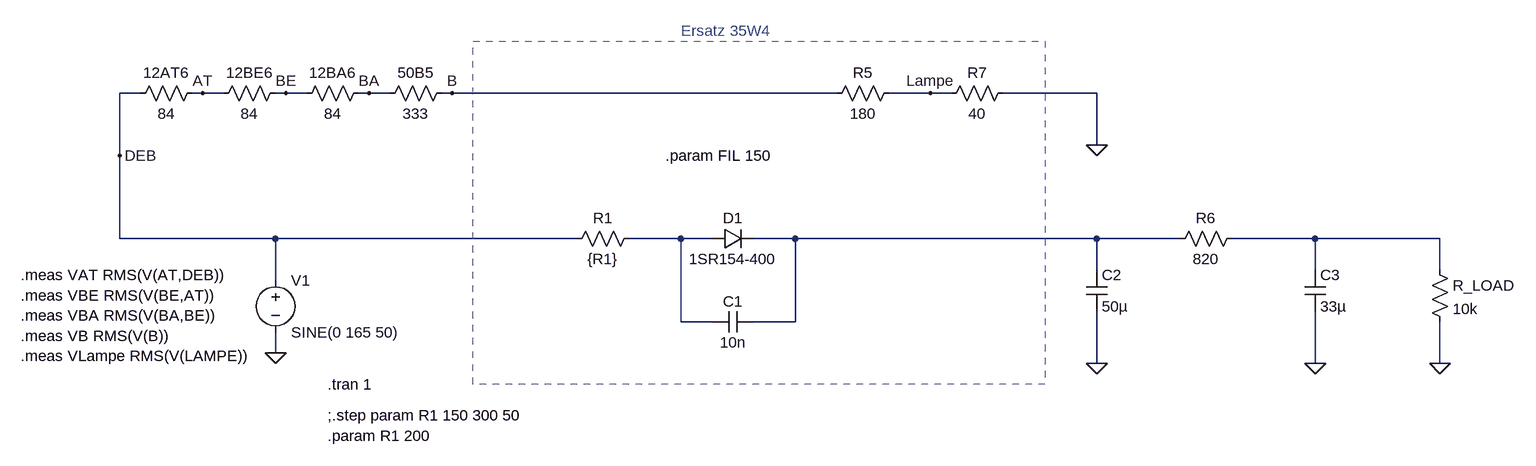
[diagram p0: schematic Ersatz-35W4.asc]
Ersatz-35W4.asc, the LTspice schematic file:
Version 4
SHEET 1 1776 680
WIRE -608 -144 -640 -144
WIRE -512 -144 -528 -144
WIRE -480 -144 -512 -144
WIRE -384 -144 -400 -144
WIRE -352 -144 -384 -144
WIRE -256 -144 -272 -144
WIRE -224 -144 -256 -144
WIRE -128 -144 -144 -144
WIRE 464 -144 -128 -144
WIRE 608 -144 544 -144
WIRE 640 -144 608 -144
WIRE 864 -144 720 -144
WIRE 864 -64 864 -144
WIRE -640 -48 -640 -144
WIRE -640 80 -640 -48
WIRE -400 80 -640 80
WIRE 64 80 -400 80
WIRE 224 80 144 80
WIRE 272 80 224 80
WIRE 400 80 336 80
WIRE 864 80 400 80
WIRE 992 80 864 80
WIRE 1200 80 1072 80
WIRE 1392 80 1200 80
WIRE 864 128 864 80
WIRE 1200 128 1200 80
WIRE 1392 128 1392 80
WIRE -400 144 -400 80
WIRE 224 208 224 80
WIRE 272 208 224 208
WIRE 400 208 400 80
WIRE 400 208 336 208
WIRE -400 256 -400 224
WIRE 864 272 864 192
WIRE 1200 272 1200 192
WIRE 1392 272 1392 208
FLAG 1392 272 0
FLAG -400 256 0
FLAG 864 272 0
FLAG 1200 272 0
FLAG 864 -64 0
FLAG -512 -144 AT
FLAG -384 -144 BE
FLAG -256 -144 BA
FLAG -128 -144 B
FLAG -640 -48 DEB
FLAG 608 -144 Lampe
SYMBOL voltage -400 128 R0
WINDOW 123 0 0 Left 0
WINDOW 39 0 0 Left 0
SYMATTR InstName V1
SYMATTR Value SINE(0 165 50)
SYMBOL res 160 64 R90
WINDOW 0 0 56 VBottom 2
WINDOW 3 32 56 VTop 2
SYMATTR InstName R1
SYMATTR Value {R1}
SYMBOL diode 272 96 R270
WINDOW 0 32 32 VTop 2
WINDOW 3 0 32 VBottom 2
SYMATTR InstName D1
SYMATTR Value 1SR154-400
SYMBOL cap 336 192 R90
WINDOW 0 0 32 VBottom 2
WINDOW 3 32 32 VTop 2
SYMATTR InstName C1
SYMATTR Value 10n
SYMBOL res 1376 112 R0
SYMATTR InstName R_LOAD
SYMATTR Value 10k
SYMBOL res 560 -160 R90
WINDOW 0 0 56 VBottom 2
WINDOW 3 32 56 VTop 2
SYMATTR InstName R5
SYMATTR Value 180
SYMBOL cap 848 128 R0
SYMATTR InstName C2
SYMATTR Value 50µ
SYMBOL cap 1184 128 R0
SYMATTR InstName C3
SYMATTR Value 33µ
SYMBOL res 1088 64 R90
WINDOW 0 0 56 VBottom 2
WINDOW 3 32 56 VTop 2
SYMATTR InstName R6
SYMATTR Value 820
SYMBOL res 736 -160 R90
WINDOW 0 0 56 VBottom 2
WINDOW 3 32 56 VTop 2
SYMATTR InstName R7
SYMATTR Value 40
SYMBOL res -128 -160 R90
WINDOW 0 0 56 VBottom 2
WINDOW 3 32 56 VTop 2
SYMATTR InstName 50B5
SYMATTR Value 333
SYMBOL res -256 -160 R90
WINDOW 0 0 56 VBottom 2
WINDOW 3 32 56 VTop 2
SYMATTR InstName 12BA6
SYMATTR Value 84
SYMBOL res -384 -160 R90
WINDOW 0 0 56 VBottom 2
WINDOW 3 32 56 VTop 2
SYMATTR InstName 12BE6
SYMATTR Value 84
SYMBOL res -512 -160 R90
WINDOW 0 0 56 VBottom 2
WINDOW 3 32 56 VTop 2
SYMATTR InstName 12AT6
SYMATTR Value 84
TEXT -320 304 Left 2 !.tran 1
TEXT 200 -48 Left 2 !.param FIL 150
TEXT -320 352 Left 2 !;.step param R1 150 300 50\n.param R1 200
TEXT 224 -240 Left 2 ;Ersatz 35W4
TEXT -792 136 Left 2 !.meas VAT RMS(V(AT,DEB))\n.meas VBE RMS(V(BE,AT))\n.meas VBA RMS(V(BA,BE))\n.meas VB RMS(V(B))\n.meas VLampe RMS(V(LAMPE))
RECTANGLE Normal 784 304 -96 -224 1

The netlist it stands for:
* Ersatz-35W4.asc
V1 DEB 0 SINE(0 165 50)
R1 N001 DEB {R1}
D1 N001 N002 1SR154-400
C1 N002 N001 10n
R_LOAD N003 0 10k
R5 Lampe B 180
C2 N002 0 50µ
C3 N003 0 33µ
R6 N003 N002 820
R7 0 Lampe 40
R§50B5 B BA 333
R§12BA6 BA BE 84
R§12BE6 BE AT 84
R§12AT6 AT DEB 84
.model D D
.lib standard.dio
.tran 1
.param FIL 150
;.step param R1 150 300 50
.param R1 200
* Ersatz 35W4
.meas VAT RMS(V(AT,DEB))
.meas VBE RMS(V(BE,AT))
.meas VBA RMS(V(BA,BE))
.meas VB RMS(V(B))
.meas VLampe RMS(V(LAMPE))
.backanno
.end